# EAGLE design Power Supply Boardtemp (EAGLE 7.5.0)
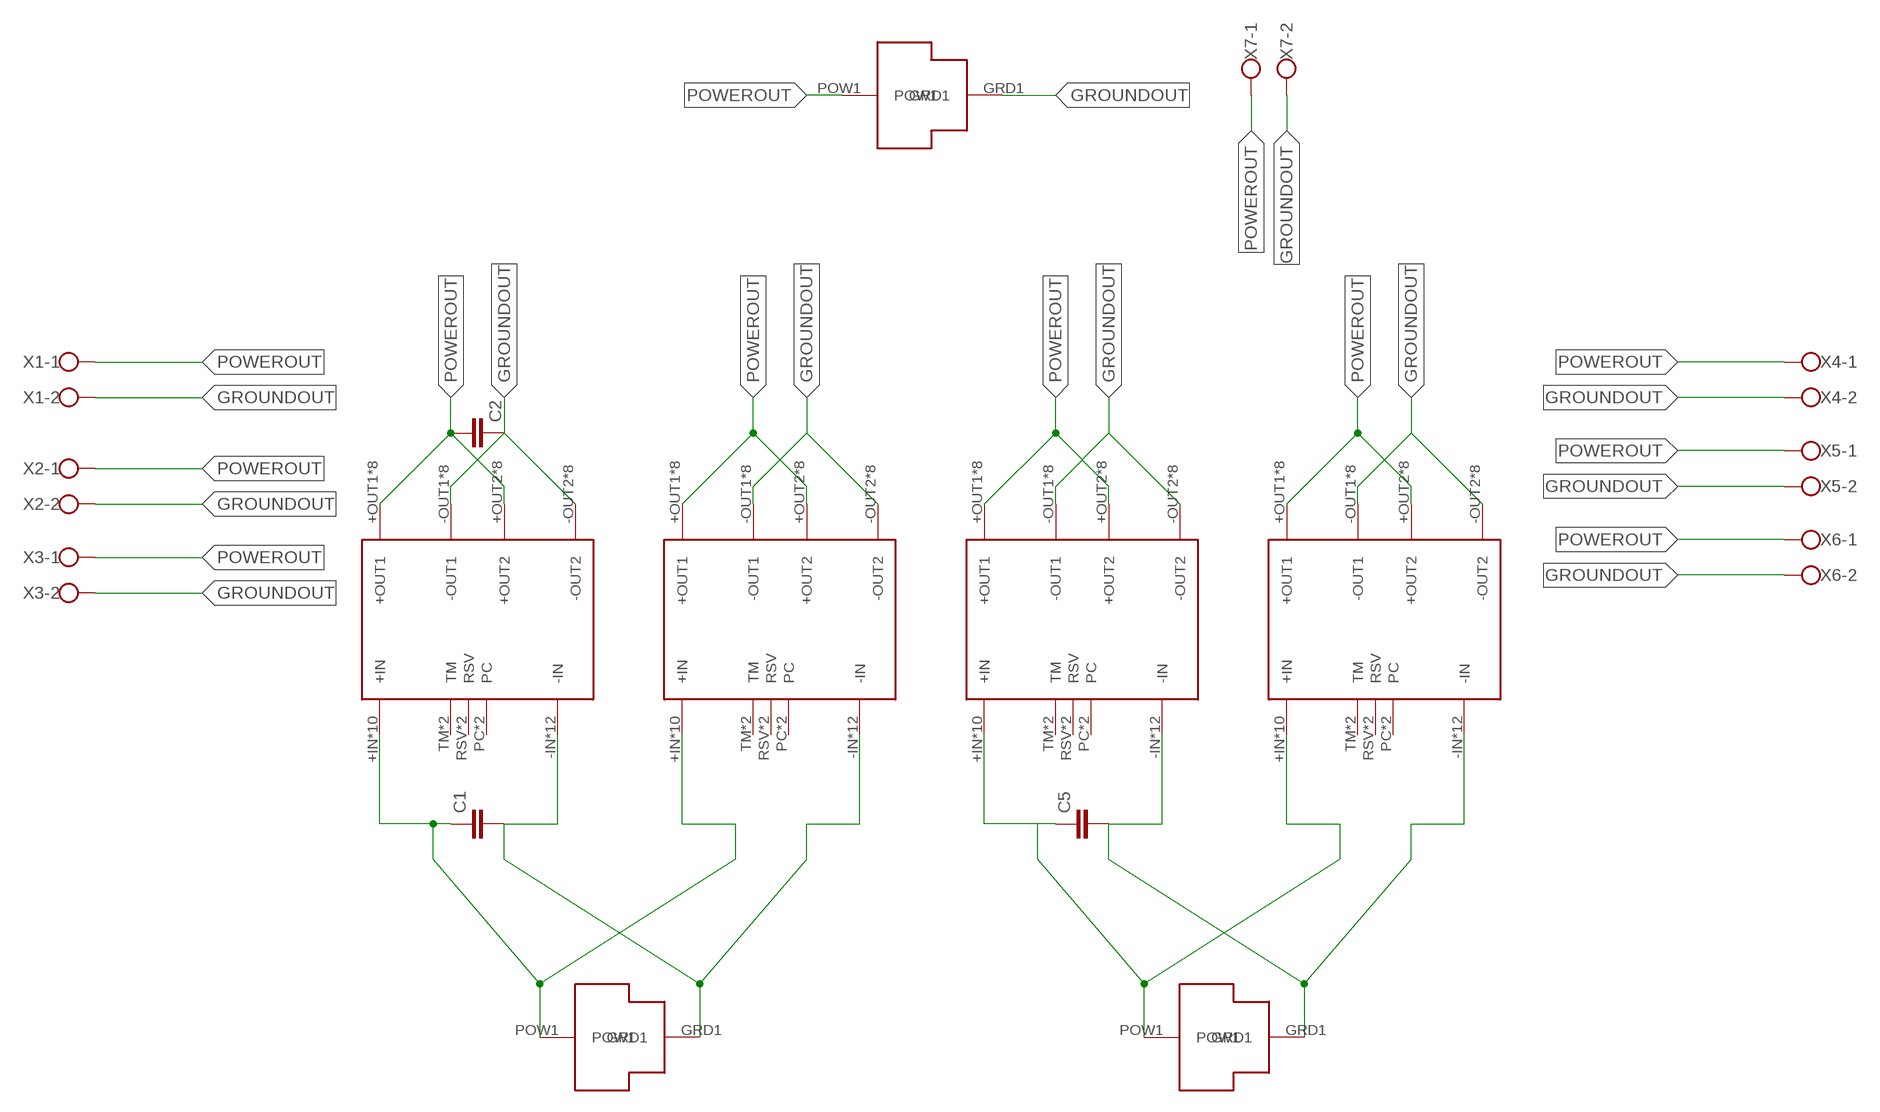
[diagram p0: schematic, sheet 1]

## Parts
C1  C2,5-3  [C2.5-3]
C2  C2,5-3  [C2.5-3]
C5  C2,5-3  [C2.5-3]
U$2  MOLEXMEGAFIT  [MOLEXMEGAFIT]
U$3  MOLEXMEGAFIT  [MOLEXMEGAFIT]
U$9  MOLEXMEGAFIT  [MOLEXMEGAFIT]
VC1  VOLTAGECONVERTER  [VOLTAGECONVERTER]
VC2  VOLTAGECONVERTER  [VOLTAGECONVERTER]
VC3  VOLTAGECONVERTER  [VOLTAGECONVERTER]
VC4  VOLTAGECONVERTER  [VOLTAGECONVERTER]
X1  W237-102  [W237-102]
X2  W237-102  [W237-102]
X3  W237-102  [W237-102]
X4  W237-102  [W237-102]
X5  W237-102  [W237-102]
X6  W237-102  [W237-102]
X7  W237-102  [W237-102]

## Nets
GROUNDIN: C1.2 C5.2 U$3.GRD1 U$9.GRD1 VC1.-IN VC1.-IN@0(-IN) VC1.-IN@1(-IN) VC1.-IN@2(-IN) VC1.-IN@3(-IN) VC1.-IN@4(-IN) VC1.-IN@5(-IN) VC1.-IN@6(-IN) VC1.-IN@7(-IN) VC1.-IN@8(-IN) VC1.-IN@9(-IN) VC1.-IN@10(-IN) VC2.-IN VC2.-IN@0(-IN) VC2.-IN@1(-IN) VC2.-IN@2(-IN) VC2.-IN@3(-IN) VC2.-IN@4(-IN) VC2.-IN@5(-IN) VC2.-IN@6(-IN) VC2.-IN@7(-IN) VC2.-IN@8(-IN) VC2.-IN@9(-IN) VC2.-IN@10(-IN) VC3.-IN VC3.-IN@0(-IN) VC3.-IN@1(-IN) VC3.-IN@2(-IN) VC3.-IN@3(-IN) VC3.-IN@4(-IN) VC3.-IN@5(-IN) VC3.-IN@6(-IN) VC3.-IN@7(-IN) VC3.-IN@8(-IN) VC3.-IN@9(-IN) VC3.-IN@10(-IN) VC4.-IN VC4.-IN@0(-IN) VC4.-IN@1(-IN) VC4.-IN@2(-IN) VC4.-IN@3(-IN) VC4.-IN@4(-IN) VC4.-IN@5(-IN) VC4.-IN@6(-IN) VC4.-IN@7(-IN) VC4.-IN@8(-IN) VC4.-IN@9(-IN) VC4.-IN@10(-IN)
GROUNDOUT: C2.1 U$2.GRD1 VC1.-OUT1 VC1.-OUT1@1(-OUT1) VC1.-OUT1@2(-OUT1) VC1.-OUT1@3(-OUT1) VC1.-OUT1@4(-OUT1) VC1.-OUT1@5(-OUT1) VC1.-OUT1@6(-OUT1) VC1.-OUT1@7(-OUT1) VC1.-OUT2 VC1.-OUT2@1(-OUT2) VC1.-OUT2@2(-OUT2) VC1.-OUT2@3(-OUT2) VC1.-OUT2@4(-OUT2) VC1.-OUT2@5(-OUT2) VC1.-OUT2@6(-OUT2) VC1.-OUT2@7(-OUT2) VC2.-OUT1 VC2.-OUT1@1(-OUT1) VC2.-OUT1@2(-OUT1) VC2.-OUT1@3(-OUT1) VC2.-OUT1@4(-OUT1) VC2.-OUT1@5(-OUT1) VC2.-OUT1@6(-OUT1) VC2.-OUT1@7(-OUT1) VC2.-OUT2 VC2.-OUT2@1(-OUT2) VC2.-OUT2@2(-OUT2) VC2.-OUT2@3(-OUT2) VC2.-OUT2@4(-OUT2) VC2.-OUT2@5(-OUT2) VC2.-OUT2@6(-OUT2) VC2.-OUT2@7(-OUT2) VC3.-OUT1 VC3.-OUT1@1(-OUT1) VC3.-OUT1@2(-OUT1) VC3.-OUT1@3(-OUT1) VC3.-OUT1@4(-OUT1) VC3.-OUT1@5(-OUT1) VC3.-OUT1@6(-OUT1) VC3.-OUT1@7(-OUT1) VC3.-OUT2 VC3.-OUT2@1(-OUT2) VC3.-OUT2@2(-OUT2) VC3.-OUT2@3(-OUT2) VC3.-OUT2@4(-OUT2) VC3.-OUT2@5(-OUT2) VC3.-OUT2@6(-OUT2) VC3.-OUT2@7(-OUT2) VC4.-OUT1 VC4.-OUT1@1(-OUT1) VC4.-OUT1@2(-OUT1) VC4.-OUT1@3(-OUT1) VC4.-OUT1@4(-OUT1) VC4.-OUT1@5(-OUT1) VC4.-OUT1@6(-OUT1) VC4.-OUT1@7(-OUT1) VC4.-OUT2 VC4.-OUT2@1(-OUT2) VC4.-OUT2@2(-OUT2) VC4.-OUT2@3(-OUT2) VC4.-OUT2@4(-OUT2) VC4.-OUT2@5(-OUT2) VC4.-OUT2@6(-OUT2) VC4.-OUT2@7(-OUT2) X1.2 X2.2 X3.2 X4.2 X5.2 X6.2 X7.2
POWERIN12: C1.1 U$3.POW1 VC1.+IN VC1.+IN@1(+IN) VC1.+IN@2(+IN) VC1.+IN@3(+IN) VC1.+IN@4(+IN) VC1.+IN@5(+IN) VC1.+IN@6(+IN) VC1.+IN@7(+IN) VC1.+IN@8(+IN) VC1.+IN@9(+IN) VC2.+IN VC2.+IN@1(+IN) VC2.+IN@2(+IN) VC2.+IN@3(+IN) VC2.+IN@4(+IN) VC2.+IN@5(+IN) VC2.+IN@6(+IN) VC2.+IN@7(+IN) VC2.+IN@8(+IN) VC2.+IN@9(+IN)
POWERIN34: C5.1 U$9.POW1 VC3.+IN VC3.+IN@1(+IN) VC3.+IN@2(+IN) VC3.+IN@3(+IN) VC3.+IN@4(+IN) VC3.+IN@5(+IN) VC3.+IN@6(+IN) VC3.+IN@7(+IN) VC3.+IN@8(+IN) VC3.+IN@9(+IN) VC4.+IN VC4.+IN@1(+IN) VC4.+IN@2(+IN) VC4.+IN@3(+IN) VC4.+IN@4(+IN) VC4.+IN@5(+IN) VC4.+IN@6(+IN) VC4.+IN@7(+IN) VC4.+IN@8(+IN) VC4.+IN@9(+IN)
POWEROUT: C2.2 U$2.POW1 VC1.+OUT1 VC1.+OUT1@1(+OUT1) VC1.+OUT1@2(+OUT1) VC1.+OUT1@3(+OUT1) VC1.+OUT1@4(+OUT1) VC1.+OUT1@5(+OUT1) VC1.+OUT1@6(+OUT1) VC1.+OUT1@7(+OUT1) VC1.+OUT2 VC1.+OUT2@1(+OUT2) VC1.+OUT2@2(+OUT2) VC1.+OUT2@3(+OUT2) VC1.+OUT2@4(+OUT2) VC1.+OUT2@5(+OUT2) VC1.+OUT2@6(+OUT2) VC1.+OUT2@7(+OUT2) VC2.+OUT1 VC2.+OUT1@1(+OUT1) VC2.+OUT1@2(+OUT1) VC2.+OUT1@3(+OUT1) VC2.+OUT1@4(+OUT1) VC2.+OUT1@5(+OUT1) VC2.+OUT1@6(+OUT1) VC2.+OUT1@7(+OUT1) VC2.+OUT2 VC2.+OUT2@1(+OUT2) VC2.+OUT2@2(+OUT2) VC2.+OUT2@3(+OUT2) VC2.+OUT2@4(+OUT2) VC2.+OUT2@5(+OUT2) VC2.+OUT2@6(+OUT2) VC2.+OUT2@7(+OUT2) VC3.+OUT1 VC3.+OUT1@1(+OUT1) VC3.+OUT1@2(+OUT1) VC3.+OUT1@3(+OUT1) VC3.+OUT1@4(+OUT1) VC3.+OUT1@5(+OUT1) VC3.+OUT1@6(+OUT1) VC3.+OUT1@7(+OUT1) VC3.+OUT2 VC3.+OUT2@1(+OUT2) VC3.+OUT2@2(+OUT2) VC3.+OUT2@3(+OUT2) VC3.+OUT2@4(+OUT2) VC3.+OUT2@5(+OUT2) VC3.+OUT2@6(+OUT2) VC3.+OUT2@7(+OUT2) VC4.+OUT1 VC4.+OUT1@1(+OUT1) VC4.+OUT1@2(+OUT1) VC4.+OUT1@3(+OUT1) VC4.+OUT1@4(+OUT1) VC4.+OUT1@5(+OUT1) VC4.+OUT1@6(+OUT1) VC4.+OUT1@7(+OUT1) VC4.+OUT2 VC4.+OUT2@1(+OUT2) VC4.+OUT2@2(+OUT2) VC4.+OUT2@3(+OUT2) VC4.+OUT2@4(+OUT2) VC4.+OUT2@5(+OUT2) VC4.+OUT2@6(+OUT2) VC4.+OUT2@7(+OUT2) X1.1 X2.1 X3.1 X4.1 X5.1 X6.1 X7.1
Unconnected: VC1.PC VC1.PC21(PC) VC1.RSV VC1.RSV@1(RSV) VC1.TM VC1.TM@1(TM) VC2.PC VC2.PC21(PC) VC2.RSV VC2.RSV@1(RSV) VC2.TM VC2.TM@1(TM) VC3.PC VC3.PC21(PC) VC3.RSV VC3.RSV@1(RSV) VC3.TM VC3.TM@1(TM) VC4.PC VC4.PC21(PC) VC4.RSV VC4.RSV@1(RSV) VC4.TM VC4.TM@1(TM)

## Library data of the parts
C1 C2 C5 = capacitor-wima:C: CAPACITOR naming: grid - package width
U$2 U$3 U$9 = MolexMegaFIT 2circuit:MOLEXMEGAFIT
VC1-VC4 = Voltage Converter Pins:VOLTAGECONVERTER
X1-X7 = con-wago-500:W237-102: WAGO SCREW CLAMP; MPN: 237-102; OC_FARNELL: unknown; OC_NEWARK: 70K9898

## Board
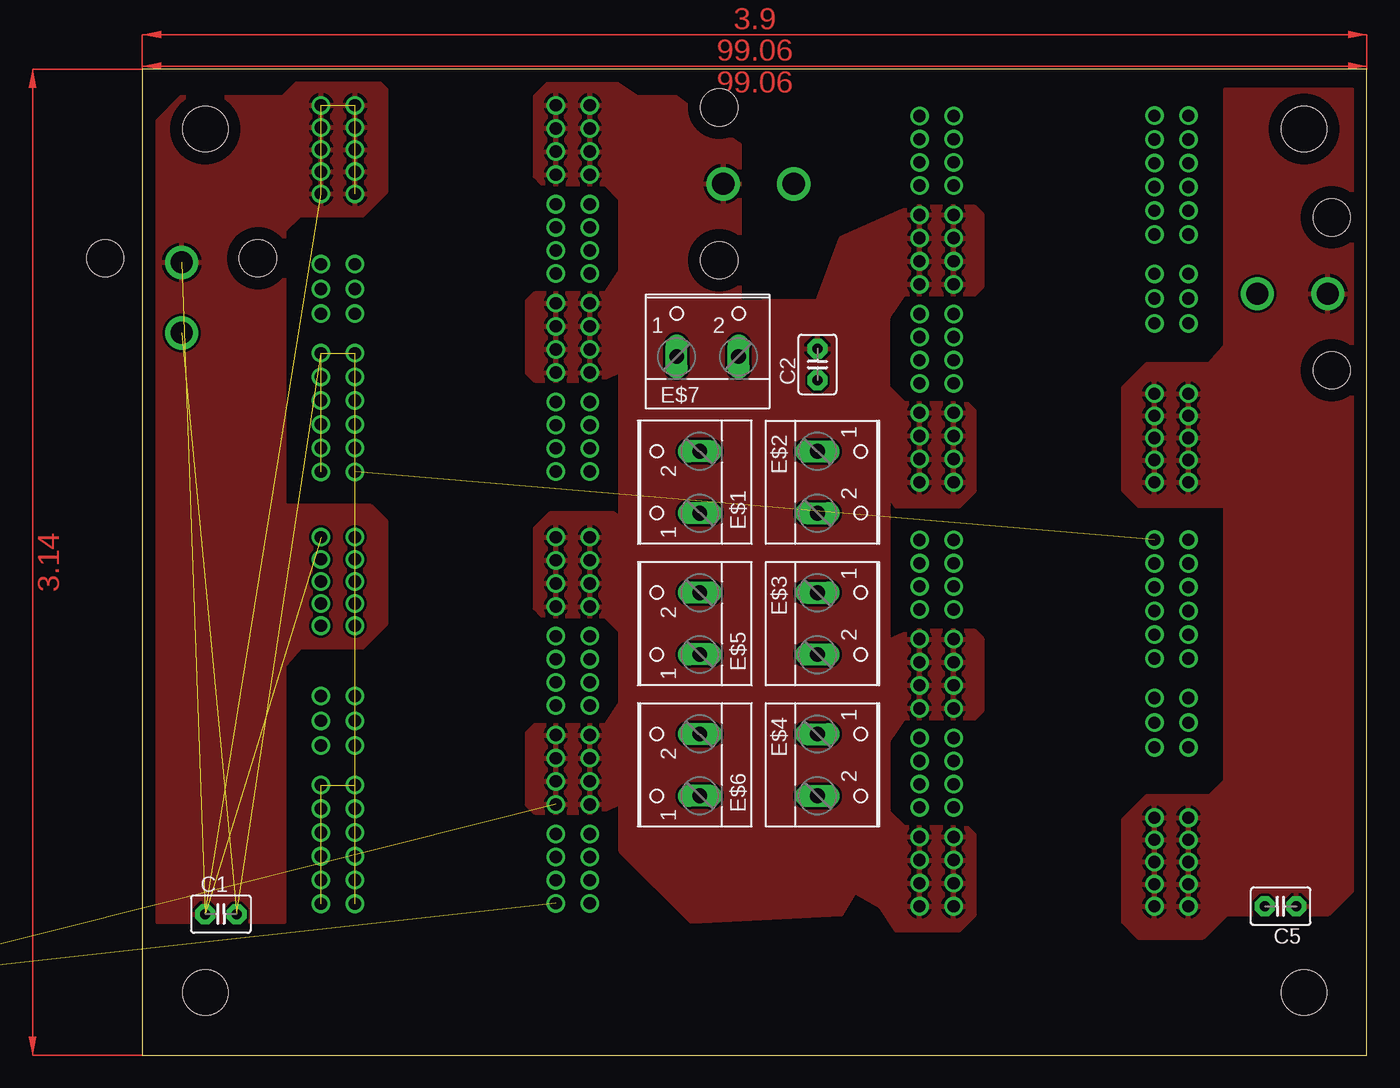
[diagram p1: board, top side]
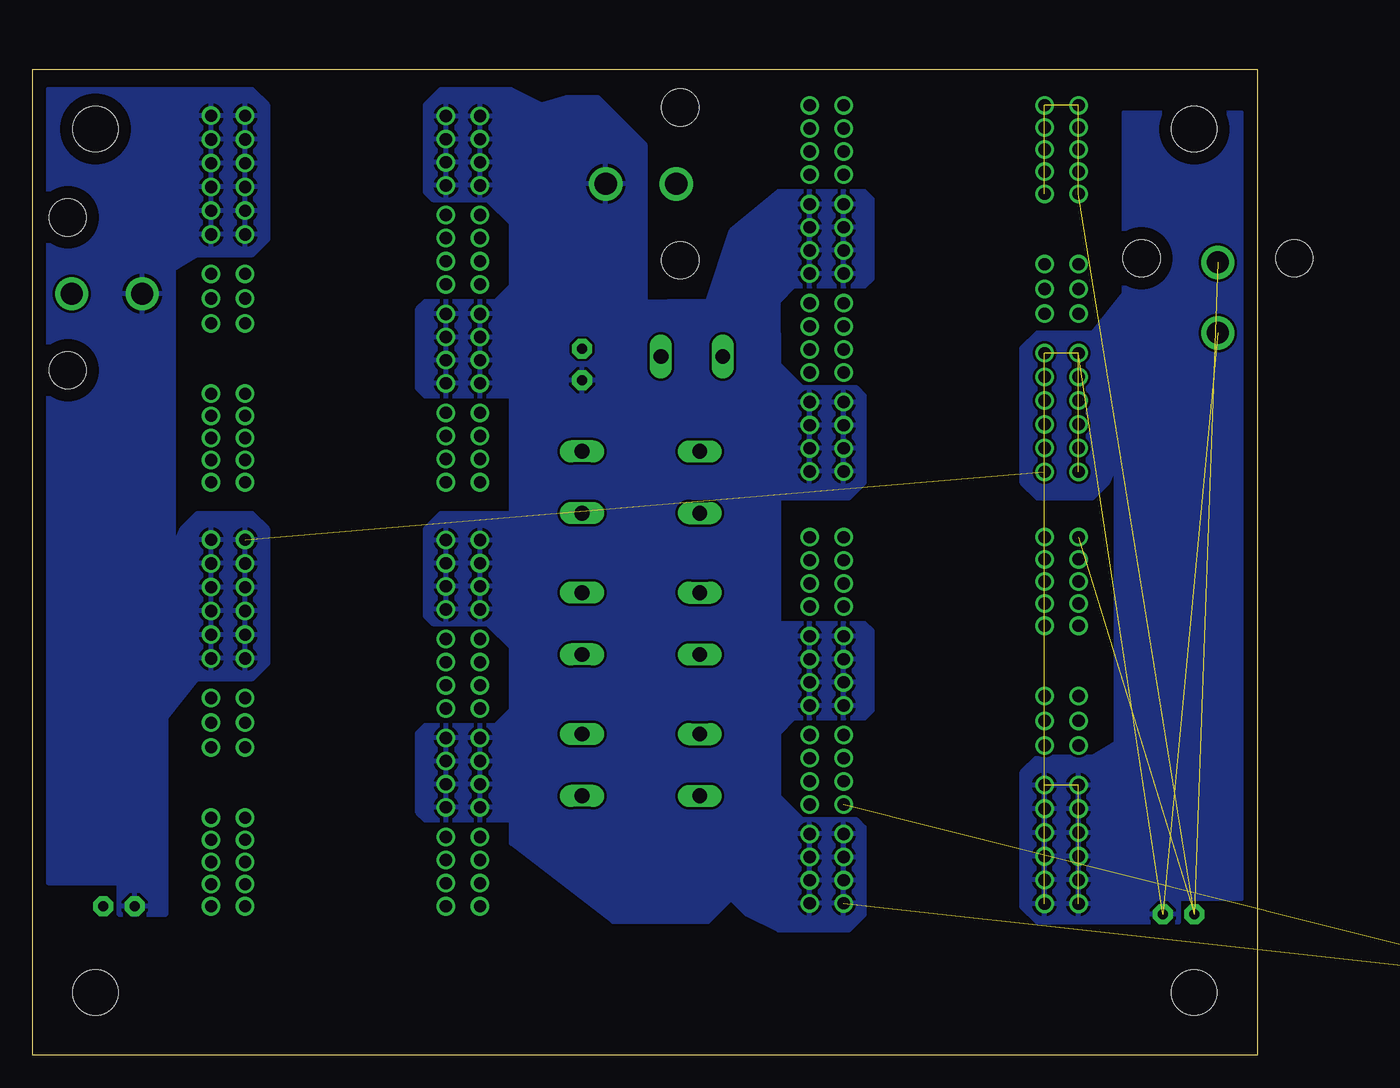
[diagram p2: board, bottom side, seen from below]

Size 99.06 x 79.76 mm. Coordinates in mm from the lower left corner, seen from the top.
Outline: 0,0 99.06,0 99.06,79.76 0,79.76 0,0
Copper layers (1*16): Top 0.035mm / dielectric 1.5mm / Bottom 0.035mm
Design rules "default *": minimum track width 10mil, minimum drill 24mil, track to track 8mil, track to pad 20mil, pad to pad 8mil, via to via 8mil, smd to smd 8mil, copper to edge 40mil, drill to drill 8mil, minimum pad ring 10mil, minimum via ring 8mil, stop-mask expansion 4mil, vias tented up to drill 0mil, thermal gap 10mil
Holes 3.66 mm at 5.08,74.93 5.08,5.08 93.98,74.93 93.98,5.08

### Footprints (pad centres in the part's own frame; a part is rotated, then mirrored left to right if it is on the bottom)
C2.5-3 = drill 0.813 pad 1.6 octagon: 1 -1.27,0; 2 1.27,0
W237-102 = drill 1.194 long: 1 -2.5,-1.27; 2 2.5,-1.27
MOLEXMEGAFIT = drill 1.8: GRD1 0,-5.7; POW1 0,0 | hole 3: -6.18,0.33; 6.18,0.33
VOLTAGECONVERTER = drill 0.99 pad 1.5: +IN -19,0; +IN@1 -19,-1.79; +IN@2 -19,-3.58; +IN@3 -19,-5.37; +IN@4 -19,-7.16; +IN@5 -21.75,0; +IN@6 -21.75,-1.79; +IN@7 -21.75,-3.58; +IN@8 -21.75,-5.37; +IN@9 -21.75,-7.16; +OUT1 0,0; +OUT1@1 0,-1.87; +OUT1@2 0,-3.74; +OUT1@3 0,-5.61; +OUT1@4 -2.75,0; +OUT1@5 -2.75,-1.87; +OUT1@6 -2.75,-3.74; +OUT1@7 -2.75,-5.61; +OUT2 0,-16; +OUT2@1 0,-17.87; +OUT2@2 0,-19.74; +OUT2@3 0,-21.61; +OUT2@4 -2.75,-16; +OUT2@5 -2.75,-17.87; +OUT2@6 -2.75,-19.74; +OUT2@7 -2.75,-21.61; -IN -19,-20.04; -IN@0 -21.75,-27.72; -IN@1 -19,-21.96; -IN@2 -19,-23.88; -IN@3 -19,-25.8; -IN@4 -19,-27.72; -IN@5 -19,-29.64; -IN@6 -21.75,-20.04; -IN@7 -21.75,-21.96; -IN@8 -21.75,-23.88; -IN@9 -21.75,-25.8; -IN@10 -21.75,-29.64; -OUT1 0,-8; -OUT1@1 0,-9.87; -OUT1@2 0,-11.74; -OUT1@3 0,-13.61; -OUT1@4 -2.75,-8; -OUT1@5 -2.75,-9.87; -OUT1@6 -2.75,-11.74; -OUT1@7 -2.75,-13.61; -OUT2 0,-24; -OUT2@1 0,-25.87; -OUT2@2 0,-27.74; -OUT2@3 0,-29.61; -OUT2@4 -2.75,-24; -OUT2@5 -2.75,-25.87; -OUT2@6 -2.75,-27.74; -OUT2@7 -2.75,-29.61; PC -21.75,-16.85; PC21 -19,-16.85; RSV -21.75,-14.85; RSV@1 -19,-14.85; TM -21.75,-12.85; TM@1 -19,-12.85

### Placement (x,y rotation side)
C1  6.35,11.43 0 top
C2  54.61,55.88 90 top
C5  92.08,12.06 180 top
E$1  [W237-102]  43.81,46.35 90 top
E$2  [W237-102]  55.88,46.35 270 top
E$3  [W237-102]  55.88,34.92 270 top
E$4  [W237-102]  55.88,23.5 270 top
E$5  [W237-102]  43.81,34.92 90 top
E$6  [W237-102]  43.81,23.5 90 top
E$7  [W237-102]  45.72,57.78 0 top
U$2  46.99,70.48 90 top
U$3  3.17,64.14 0 top
U$9  95.89,61.59 270 top
VC1  36.2,76.83 0 top
VC2  36.2,41.91 0 top
VC3  62.87,46.35 180 top
VC4  62.87,12.06 180 top
X1  -17.14,8.26 0 top  (outside the outline)
X2  -27.3,8.26 0 top  (outside the outline)
X3  -37.47,8.26 0 top  (outside the outline)
X4  -47.62,8.26 0 top  (outside the outline)
X5  -57.78,8.26 0 top  (outside the outline)
X6  -67.94,8.26 0 top  (outside the outline)
X7  -78.11,8.26 0 top  (outside the outline)

### Tracks (layer width: path | path; a pad name or v marks a point on that pad's centre or on a via)
GROUNDIN  (26 unrouted)
  pour Bottom: 97.79,35.56 97.79,13.97 92.08,13.97 92.08,11.43 88.27,11.43 88.27,27.3 85.72,30.48 81.28,30.48 80.01,31.75 80.01,42.55 81.28,43.81 85.72,43.81 87,42.55 89.53,36.83 96.52,36.83
  pour Bottom: 97.79,62.87 88.9,62.87 85.72,64.77 81.28,64.77 80.01,66.04 80.01,76.83 81.28,78.11 97.79,78.11
  pour Bottom: 87.63,34.29 87.63,66.67 95.25,66.67 97.79,64.14 97.79,34.29 97.16,33.66
  pour Bottom: 1.27,26.04 10.16,26.04 13.34,24.13 17.78,24.13 19.05,22.86 19.05,12.06 17.78,10.79 6.35,10.79 6.35,12.7 1.27,12.7
GROUNDIN1
  pour Bottom: 1.27,53.34 1.27,76.2 10.79,76.2 10.79,61.59 13.34,58.42 17.78,58.42 19.05,57.15 19.05,46.35 17.78,45.09 13.34,45.09 12.06,46.35 9.53,52.07 2.54,52.07
  pour Bottom: 11.43,54.61 11.43,22.23 3.81,22.23 1.27,24.77 1.27,54.61 1.91,55.24
GROUNDOUT  (7 unrouted)
  pour Bottom: 31.75,46.35 31.75,53.34 32.38,53.98 36.83,53.98 38.73,55.88 38.73,60.96 37.47,62.23 31.75,62.23 31.11,62.87 31.11,69.22 31.75,69.85 38.73,69.85 42.55,66.67 44.45,60.96 47.62,60.96 48.9,59.69 48.9,52.7 47.62,50.8 46.99,50.8 45.09,49.53 43.81,48.9 41.27,46.35 38.73,45.09 33.02,45.09
  pour Bottom: 53.34,77.47 49.53,73.66 49.53,60.96 42.55,60.96 38.73,58.42 38.73,16.51 44.45,10.79 52.07,10.79 60.33,17.14 60.33,76.2 55.88,77.47
  pour Bottom: 67.31,76.83 67.31,69.85 66.67,69.22 62.23,69.22 60.33,67.31 60.33,62.23 61.59,60.96 67.31,60.96 67.94,60.33 67.94,53.98 67.31,53.34 60.33,53.34 56.52,56.52 54.61,62.23 51.44,62.23 50.16,63.5 50.16,70.48 51.44,72.39 52.07,72.39 53.98,73.66 55.24,74.3 57.78,76.83 60.33,78.11 66.04,78.11
  pour Bottom: 67.31,42.55 67.31,35.56 66.67,34.92 62.23,34.92 60.33,33.02 60.33,27.94 61.59,26.67 67.31,26.67 67.94,26.04 67.94,19.68 67.31,19.05 60.33,19.05 56.52,22.23 54.61,27.94 53.34,27.94 52.07,29.21 52.07,36.2 53.34,38.1 53.98,38.1 55.88,39.37 55.24,40.01 57.78,42.55 60.33,43.81 66.04,43.81
  pour Bottom: 31.75,11.43 31.75,18.41 32.38,19.05 36.83,19.05 38.73,20.95 38.73,26.04 37.47,27.3 31.75,27.3 31.11,27.94 31.11,34.29 31.75,34.92 38.73,34.92 42.55,31.75 44.45,26.04 47.62,26.04 48.9,24.77 48.9,17.78 47.62,15.88 46.99,15.88 45.09,14.61 43.81,13.97 41.27,11.43 38.73,10.16 33.02,10.16
POWERIN1
  pour Top: 1.27,27.94 1.27,31.11 3.81,34.92 9.53,34.92 10.16,44.45 18.41,44.45 19.68,43.18 19.68,34.92 17.78,33.02 12.7,33.02 8.26,27.94
POWERIN12  (12 unrouted)
  pour Top: 1.27,10.79 1.27,75.56 3.17,77.47 11.43,77.47 13.34,79.38 18.41,79.38 19.68,78.11 19.68,69.85 17.78,67.94 12.7,67.94 11.43,66.67 11.43,10.79
POWERIN34
  pour Top: 97.79,78.11 97.79,13.34 95.89,11.43 87.63,11.43 85.72,9.53 80.64,9.53 79.38,10.79 79.38,19.05 81.28,20.95 86.36,20.95 87.63,22.23 87.63,78.11
  pour Top: 97.79,60.96 97.79,57.78 95.25,53.98 89.53,53.98 88.9,44.45 80.64,44.45 79.38,45.72 79.38,53.98 81.28,55.88 86.36,55.88 90.81,60.96
POWEROUT  (7 unrouted)
  pour Top: 33.02,78.74 31.75,77.47 31.75,71.12 32.38,70.48 37.47,70.48 38.73,69.22 38.73,63.5 37.47,61.59 31.75,61.59 31.11,60.96 31.11,55.24 31.75,54.61 36.83,54.61 42.55,57.15 44.45,62.23 46.99,62.23 46.99,73.03 45.09,73.03 43.81,74.3 40.01,77.47 38.1,78.74
  pour Top: 43.18,77.47 48.26,73.66 48.26,60.96 53.98,60.96 60.33,52.07 60.33,17.78 56.52,11.43 44.45,10.79 38.73,16.51 38.73,77.47
  pour Top: 66.04,44.45 67.31,45.72 67.31,52.07 66.67,52.7 61.59,52.7 60.33,53.98 60.33,59.69 61.59,61.59 67.31,61.59 67.94,62.23 67.94,67.94 67.31,68.58 62.23,68.58 56.52,66.04 54.61,60.96 50.16,60.96 50.16,50.16 52.07,50.16 55.24,48.9 59.69,46.35 60.96,44.45
  pour Top: 66.04,10.16 67.31,11.43 67.31,17.78 66.67,18.41 61.59,18.41 60.33,19.68 60.33,25.4 61.59,27.3 67.31,27.3 67.94,27.94 67.94,33.66 67.31,34.29 62.23,34.29 56.52,31.75 54.61,26.67 52.07,26.67 52.07,15.88 53.98,15.88 55.24,14.61 59.69,12.06 60.96,10.16
  pour Top: 33.02,43.81 31.75,42.55 31.75,36.2 32.38,35.56 37.47,35.56 38.73,34.29 38.73,28.57 37.47,26.67 31.75,26.67 31.11,26.04 31.11,20.32 31.75,19.68 36.83,19.68 42.55,22.23 44.45,27.3 46.99,27.3 46.99,38.1 45.09,38.1 43.81,39.37 40.01,42.55 38.1,43.81
(copper drawn outside any net)
  shapes: Top area x4